# Altium schematic sheet Notes.SchDoc
size A4
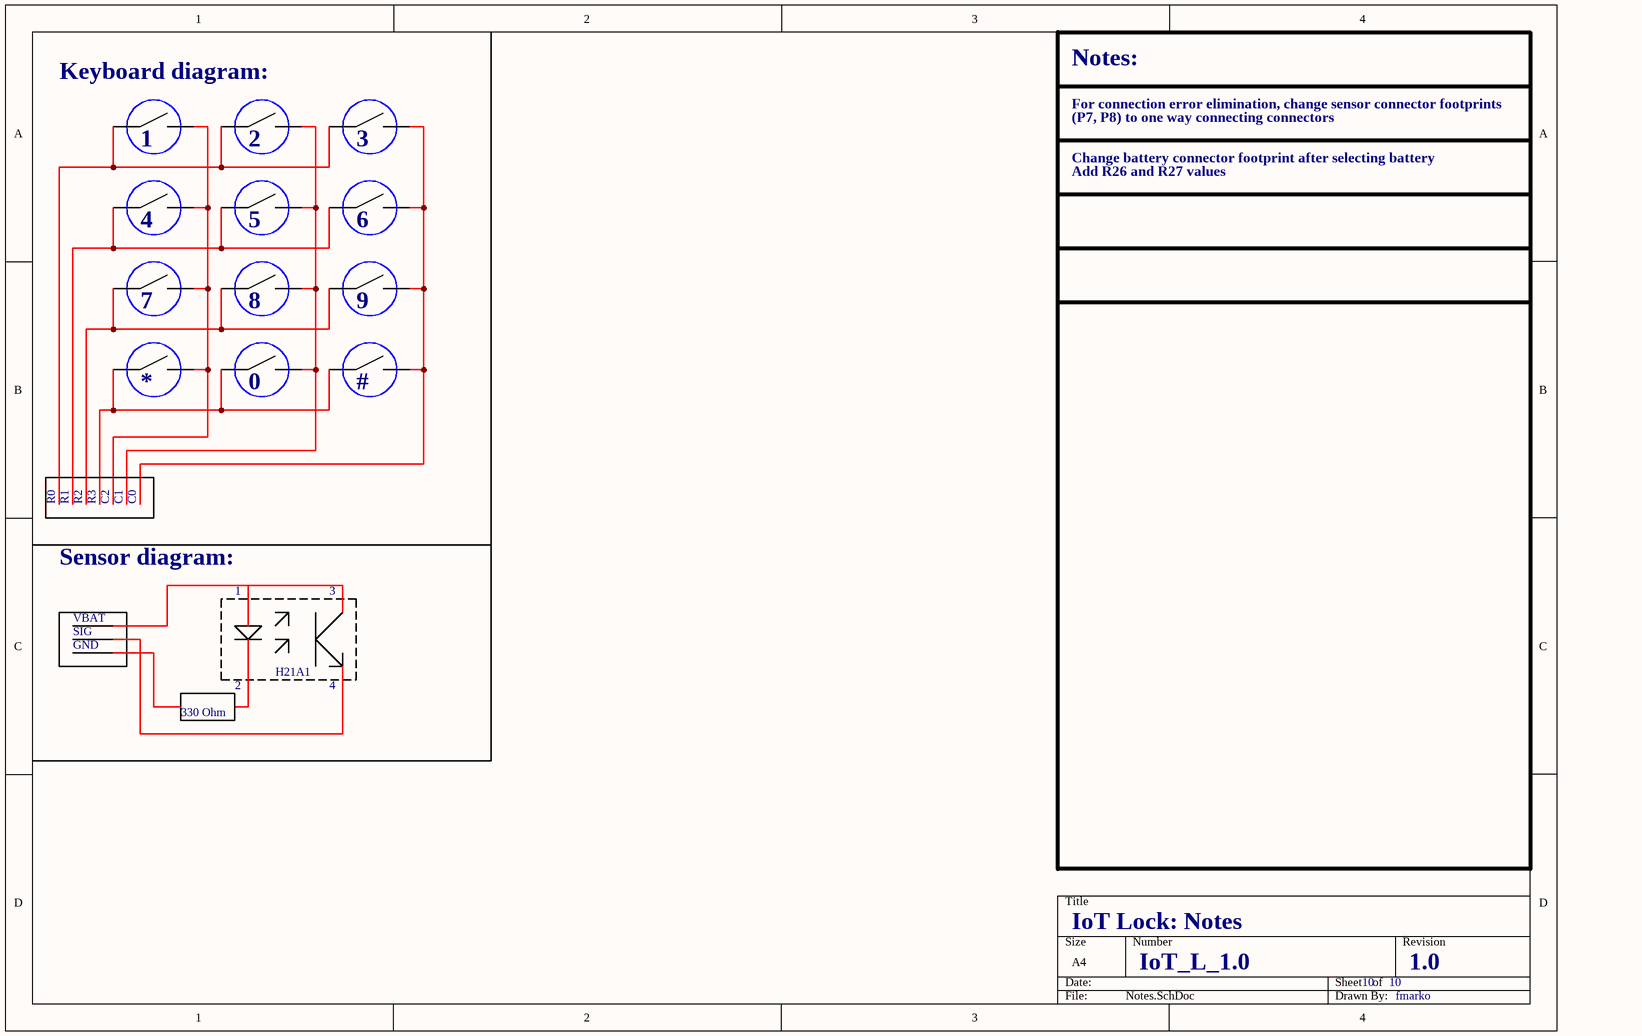
[diagram p0: Notes.SchDoc]

## Notes on the sheet
- Keyboard diagram:
- Notes:
- For connection error elimination, change sensor connector footprints
- 1
- 2
- 3
- (P7, P8) to one way connecting connectors
- Change battery connector footprint after selecting battery
- Add R26 and R27 values
- 4
- 5
- 6
- 7
- 8
- 9
- *
- 0
- #
- R0
- R1
- R2
- R3
- C2
- C1
- C0
- Sensor diagram:
- VBAT
- SIG
- GND
- 330 Ohm
- H21A1
- IoT Lock: Notes
- IoT_L_1.0
- 10
- 1.0
- fmarko